# Altium schematic sheet MCU-power.SchDoc
size A; SheetNumber: 6; SheetTotal: 7
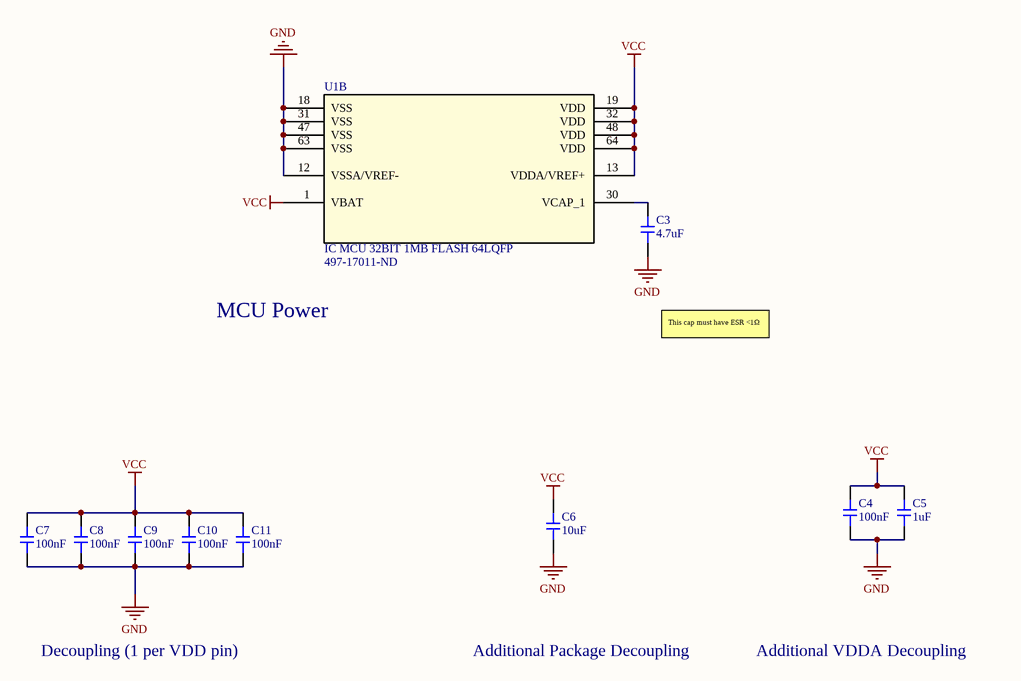
[diagram p0: MCU-power.SchDoc]

## Parts
C3  Capacitance: 4.7uF  [CAP-0603]  (hidden comment: CL10A475KO8NNNC)
C4  Capacitance: 100nF  [CAP-0603]  (hidden comment: CC0603KRX7R9BB104)
C5  Capacitance: 1uF  [CAP-0603]  (hidden comment: CL10A105KB8NNNC)
C6  Capacitance: 10uF  [CAP-0603]  (hidden comment: CL10A106KP8NNNC)
C7  Capacitance: 100nF  [CAP-0603]  (hidden comment: CC0603KRX7R9BB104)
C8  Capacitance: 100nF  [CAP-0603]  (hidden comment: CC0603KRX7R9BB104)
C9  Capacitance: 100nF  [CAP-0603]  (hidden comment: CC0603KRX7R9BB104)
C10  Capacitance: 100nF  [CAP-0603]  (hidden comment: CC0603KRX7R9BB104)
C11  Capacitance: 100nF  [CAP-0603]  (hidden comment: CC0603KRX7R9BB104)
U1  IC MCU 32BIT 1MB FLASH 64LQFP  Supplier Part Number 1: 497-17011-ND  [LQFP64-10x10mm]  (part B of 2)

## Nets
GND: C3.1 C4.1 C5.1 C6.1 C7.1 C8.1 C9.1 C10.1 C11.1 U1.12(VSSA/VREF-) U1.18(VSS) U1.31(VSS) U1.47(VSS) U1.63(VSS)
VCC: C4.2 C5.2 C6.2 C7.2 C8.2 C9.2 C10.2 C11.2 U1.1(VBAT) U1.13(VDDA/VREF+) U1.19(VDD) U1.32(VDD) U1.48(VDD) U1.64(VDD)
NetC3_2: C3.2 U1.30(VCAP_1)

## Notes on the sheet
- MCU Power
- This cap must have ESR <1Ω
- Decoupling (1 per VDD pin)
- Additional Package Decoupling
- Additional VDDA Decoupling

## Library data of the parts
C3 = CL10A475KO8NNNC: Capacitor, Ceramic (MLCC), 4.7uF, ±10%, 16V, X5R, ±10%, SMD 0603; Manufacturer: Samsung Electro-Mechanics; Temperature Rating: -55°C ~ 85°C; Capacitance @ 1V DC Bias: 4.097uF; Capacitance @ 1.2V DC Bias: 4.030uF; Capacitance @ 1.35V DC Bias: 3.972uF; Capacitance @ 1.5V DC Bias: 3.908uF; Capacitance @ 1.8V DC Bias: 3.769uF; Capacitance @ 2.5V DC Bias: 3.406uF; Capacitance @ 3.3V DC Bias: 2.969uF; Capacitance @ 3.7V DC Bias: 2.760uF; Capacitance @ 4.2V DC Bias: 2.508uF; Capacitance @ 5V DC Bias: 2.138uF; Capacitance @ 9V DC Bias: 1.155uF; Capacitance @ 12V DC Bias: 0.873uF; Capacitance @ 15V DC Bias: 0.647uF; Impedance (0V Bias) @ 100Hz: 437Ω; Impedance (0V Bias) @ 500Hz: 90.6Ω; Impedance (0V Bias) @ 1kHz: 46Ω; Impedance (0V Bias) @ 5kHz: 9.51Ω; Impedance (0V Bias) @ 10kHz: 4.83Ω; Impedance (0V Bias) @ 50kHz: 0.996Ω; Impedance (0V Bias) @ 100kHz: 0.505Ω; Impedance (0V Bias) @ 500kHz: 0.104Ω; Impedance (0V Bias) @ 1MHz: 0.05Ω; Impedance (0V Bias) @ 5MHz: 0.011Ω; Impedance (0V Bias) @ 10MHz: 0.0248Ω; Impedance (0V Bias) @ 50MHz: 0.0811Ω; Impedance (0V Bias) @ 100MHz: 0.141Ω; Impedance (0V Bias) @ 500MHz: 0.57Ω; Impedance (0V Bias) @ 1GHz: 1.02Ω; Impedance (0V Bias) @ 2GHz: 2.37Ω; Impedance (0V Bias) @ 5GHz: 4.65Ω; Impedance (16V Bias) @ 100Hz: 3.74E+03Ω; Impedance (16V Bias) @ 500Hz: 758Ω; Impedance (16V Bias) @ 1kHz: 381Ω; Impedance (16V Bias) @ 5kHz: 77.1Ω; Impedance (16V Bias) @ 10kHz: 38.7Ω; Impedance (16V Bias) @ 50kHz: 7.82Ω; Impedance (16V Bias) @ 100kHz: 3.93Ω; Impedance (16V Bias) @ 500kHz: 0.79Ω; Impedance (16V Bias) @ 1MHz: 0.386Ω; Impedance (16V Bias) @ 5MHz: 0.077Ω; Impedance (16V Bias) @ 10MHz: 0.0173Ω; Impedance (16V Bias) @ 50MHz: 0.0836Ω; Impedance (16V Bias) @ 100MHz: 0.142Ω; Impedance (16V Bias) @ 500MHz: 0.585Ω; Impedance (16V Bias) @ 1GHz: 1.06Ω; Impedance (16V Bias) @ 2GHz: 2.36Ω; Impedance (16V Bias) @ 5GHz: 4.63Ω; Package Size: 0603; JLCPCB Basic Part: Yes; JLCPCB Part Number: C19666; Supplier 1: LCSC; Category: Capacitors - MLCC; Supplier Part Number 1: C19666; Manufacturer Part Number: CL10A475KO8NNNC; Tolerance: ±10%; Voltage Rating: 16V; Temperature Coefficient: X5R; RoHS: Yes; ComponentLink1Description: Datasheet; ComponentLink1URL: https://wmsc.lcsc.com/wmsc/upload/file/pdf/v2/lcsc/2304140030_Samsung-Electro-Mechanics-CL10A475KO8NNNC_C19666.pdf; ComponentLink2Description: JLCPCB Part URL; ComponentLink2URL: https://jlcpcb.com/partdetail/C19666; ComponentLink3Description: LCSC Part URL; ComponentLink3URL: https://lcsc.com/product-detail/Multilayer-Ceramic-Capacitors-MLCC---SMD-SMT_Samsung-Electro-Mechanics-Samsung-Electro-Mechanics-CL10A475KO8NNNC_C19666.html; ComponentLink4Description: Samsung Component Library; ComponentLink4URL: https://weblib.samsungsem.com/mlcc/mlcc-ec.do?partNumber=CL10A475KO8NNN
C4 C7-C11 = CC0603KRX7R9BB104: Capacitor, Ceramic (MLCC), 100nF, ±10%, 50V, X7R, ±10%, SMD 0603; Manufacturer: YAGEO; Package Size: 0603; JLCPCB Basic Part: Yes; JLCPCB Part Number: C14663; Supplier 1: LCSC; Category: Capacitors - MLCC; Supplier Part Number 1: C14663; Manufacturer Part Number: CC0603KRX7R9BB104; Tolerance: ±10%; Voltage Rating: 50V; Temperature Coefficient: X7R; RoHS: Yes; ComponentLink1Description: Datasheet; ComponentLink1URL: https://wmsc.lcsc.com/wmsc/upload/file/pdf/v2/lcsc/2211101700_YAGEO-CC0603KRX7R9BB104_C14663.pdf; ComponentLink2Description: JLCPCB Part URL; ComponentLink2URL: https://jlcpcb.com/partdetail/C14663; ComponentLink3Description: LCSC Part URL; ComponentLink3URL: https://lcsc.com/product-detail/Multilayer-Ceramic-Capacitors-MLCC---SMD-SMT_YAGEO-YAGEO-CC0603KRX7R9BB104_C14663.html
C5 = CL10A105KB8NNNC: Capacitor, Ceramic (MLCC), 1uF, ±10%, 50V, X5R, ±10%, SMD 0603; Manufacturer: Samsung Electro-Mechanics; Temperature Rating: -55°C ~ 85°C; Capacitance @ 1V DC Bias: 1.054uF; Capacitance @ 1.2V DC Bias: 1.044uF; Capacitance @ 1.35V DC Bias: 1.035uF; Capacitance @ 1.5V DC Bias: 1.027uF; Capacitance @ 1.8V DC Bias: 1.007uF; Capacitance @ 2.5V DC Bias: 0.947uF; Capacitance @ 3.3V DC Bias: 0.865uF; Capacitance @ 3.7V DC Bias: 0.824uF; Capacitance @ 4.2V DC Bias: 0.773uF; Capacitance @ 5V DC Bias: 0.695uF; Capacitance @ 9V DC Bias: 0.410uF; Capacitance @ 12V DC Bias: 0.308uF; Capacitance @ 15V DC Bias: 0.231uF; Capacitance @ 24V DC Bias: 0.130uF; Capacitance @ 36V DC Bias: 0.080uF; Capacitance @ 48V DC Bias: 0.063uF; Impedance (0V Bias) @ 100Hz: 1.84E+03Ω; Impedance (0V Bias) @ 500Hz: 378Ω; Impedance (0V Bias) @ 1kHz: 191Ω; Impedance (0V Bias) @ 5kHz: 39.1Ω; Impedance (0V Bias) @ 10kHz: 19.8Ω; Impedance (0V Bias) @ 50kHz: 4.04Ω; Impedance (0V Bias) @ 100kHz: 2.04Ω; Impedance (0V Bias) @ 500kHz: 0.416Ω; Impedance (0V Bias) @ 1MHz: 0.208Ω; Impedance (0V Bias) @ 5MHz: 0.0293Ω; Impedance (0V Bias) @ 10MHz: 0.0159Ω; Impedance (0V Bias) @ 50MHz: 0.0822Ω; Impedance (0V Bias) @ 100MHz: 0.14Ω; Impedance (0V Bias) @ 500MHz: 0.54Ω; Impedance (0V Bias) @ 1GHz: 0.988Ω; Impedance (0V Bias) @ 2GHz: 2.38Ω; Impedance (0V Bias) @ 5GHz: 4.94Ω; Package Size: 0603; JLCPCB Basic Part: Yes; JLCPCB Part Number: C15849; Supplier 1: LCSC; Category: Capacitors - MLCC; Supplier Part Number 1: C15849; Manufacturer Part Number: CL10A105KB8NNNC; Tolerance: ±10%; Voltage Rating: 50V; Temperature Coefficient: X5R; RoHS: Yes; ComponentLink1Description: Datasheet; ComponentLink1URL: https://wmsc.lcsc.com/wmsc/upload/file/pdf/v2/lcsc/2304140030_Samsung-Electro-Mechanics-CL10A105KB8NNNC_C15849.pdf; ComponentLink2Description: JLCPCB Part URL; ComponentLink2URL: https://jlcpcb.com/partdetail/C15849; ComponentLink3Description: LCSC Part URL; ComponentLink3URL: https://lcsc.com/product-detail/Multilayer-Ceramic-Capacitors-MLCC---SMD-SMT_Samsung-Electro-Mechanics-Samsung-Electro-Mechanics-CL10A105KB8NNNC_C15849.html; ComponentLink4Description: Samsung Component Library; ComponentLink4URL: https://weblib.samsungsem.com/mlcc/mlcc-ec.do?partNumber=CL10A105KB8NNN
C6 = CL10A106KP8NNNC: Capacitor, Ceramic (MLCC), 10uF, ±10%, 10V, X5R, ±10%, SMD 0603; Manufacturer: Samsung Electro-Mechanics; Temperature Rating: -55°C ~ 85°C; Capacitance @ 1V DC Bias: 8.451uF; Capacitance @ 1.2V DC Bias: 8.084uF; Capacitance @ 1.35V DC Bias: 7.793uF; Capacitance @ 1.5V DC Bias: 7.497uF; Capacitance @ 1.8V DC Bias: 6.915uF; Capacitance @ 2.5V DC Bias: 5.691uF; Capacitance @ 3.3V DC Bias: 4.464uF; Capacitance @ 3.7V DC Bias: 3.996uF; Capacitance @ 4.2V DC Bias: 3.516uF; Capacitance @ 5V DC Bias: 2.897uF; Capacitance @ 9V DC Bias: 1.372uF; Impedance (0V Bias) @ 100Hz: 217Ω; Impedance (0V Bias) @ 500Hz: 44.6Ω; Impedance (0V Bias) @ 1kHz: 22.6Ω; Impedance (0V Bias) @ 5kHz: 4.64Ω; Impedance (0V Bias) @ 10kHz: 2.35Ω; Impedance (0V Bias) @ 50kHz: 0.481Ω; Impedance (0V Bias) @ 100kHz: 0.243Ω; Impedance (0V Bias) @ 500kHz: 0.0484Ω; Impedance (0V Bias) @ 1MHz: 0.0217Ω; Impedance (0V Bias) @ 5MHz: 0.0144Ω; Impedance (0V Bias) @ 10MHz: 0.0227Ω; Impedance (0V Bias) @ 50MHz: 0.0729Ω; Impedance (0V Bias) @ 100MHz: 0.123Ω; Impedance (0V Bias) @ 500MHz: 0.439Ω; Impedance (0V Bias) @ 1GHz: 0.788Ω; Impedance (0V Bias) @ 2GHz: 1.8Ω; Impedance (0V Bias) @ 5GHz: 3.33Ω; Impedance (10V Bias) @ 100Hz: 1.6E+03Ω; Impedance (10V Bias) @ 500Hz: 323Ω; Impedance (10V Bias) @ 1kHz: 162Ω; Impedance (10V Bias) @ 5kHz: 32.7Ω; Impedance (10V Bias) @ 10kHz: 16.4Ω; Impedance (10V Bias) @ 50kHz: 3.3Ω; Impedance (10V Bias) @ 100kHz: 1.66Ω; Impedance (10V Bias) @ 500kHz: 0.331Ω; Impedance (10V Bias) @ 1MHz: 0.161Ω; Impedance (10V Bias) @ 5MHz: 0.0215Ω; Impedance (10V Bias) @ 10MHz: 0.0228Ω; Impedance (10V Bias) @ 50MHz: 0.0759Ω; Impedance (10V Bias) @ 500MHz: 0.443Ω; Impedance (10V Bias) @ 1GHz: 0.786Ω; Impedance (10V Bias) @ 2GHz: 1.77Ω; Impedance (10V Bias) @ 5GHz: 3.28Ω; Package Size: 0603; JLCPCB Basic Part: Yes; JLCPCB Part Number: C19702; Supplier 1: LCSC; Category: Capacitors - MLCC; Supplier Part Number 1: C19702; Manufacturer Part Number: CL10A106KP8NNNC; Tolerance: ±10%; Voltage Rating: 10V; Temperature Coefficient: X5R; RoHS: Yes; ComponentLink1Description: Datasheet; ComponentLink1URL: https://wmsc.lcsc.com/wmsc/upload/file/pdf/v2/lcsc/2304140030_Samsung-Electro-Mechanics-CL10A106KP8NNNC_C19702.pdf; ComponentLink2Description: JLCPCB Part URL; ComponentLink2URL: https://jlcpcb.com/partdetail/C19702; ComponentLink3Description: LCSC Part URL; ComponentLink3URL: https://lcsc.com/product-detail/Multilayer-Ceramic-Capacitors-MLCC---SMD-SMT_Samsung-Electro-Mechanics-Samsung-Electro-Mechanics-CL10A106KP8NNNC_C19702.html; ComponentLink4Description: Samsung Component Library; ComponentLink4URL: https://weblib.samsungsem.com/mlcc/mlcc-ec.do?partNumber=CL10A106KP8NNN; Impedance (10V Bias) @ 100MHz: 0.123Ω
U1 = STM32F4xxR2_minimalist: ARM® Cortex®-M4 STM32F4 Microcontroller IC 32-Bit 100MHz 1MB (1M x 8) FLASH 64-LQFP (10x10); Vendor: STMicroelectronics; C: Copyright (C) 2016 Accelerated Designs. All rights reserved; Manufacturer_Part_Number: stm32f4xxr2; Copyright: Copyright (C) 2016 Accelerated Designs. All rights reserved; RefDes: RefDes; Type: Type; Value: Value; Supplier 1: Digi-Key